# EAGLE board max10adc_v9.0_32chan_frontendtest1 (EAGLE 9.2.0)
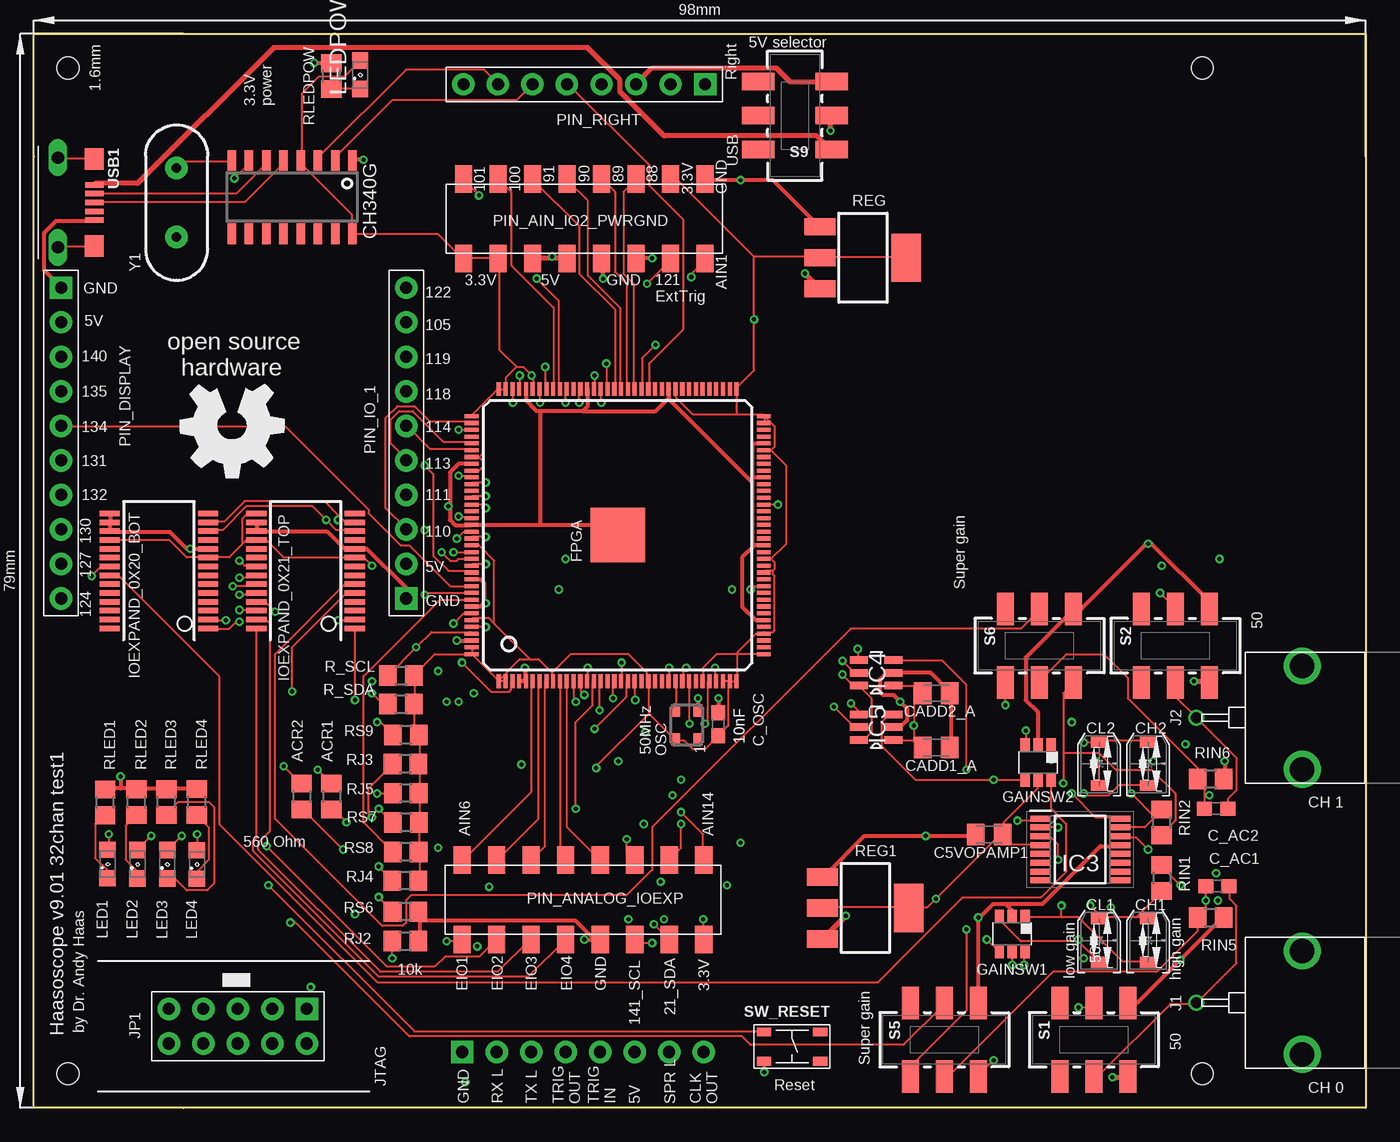
[diagram p3: board, top side]
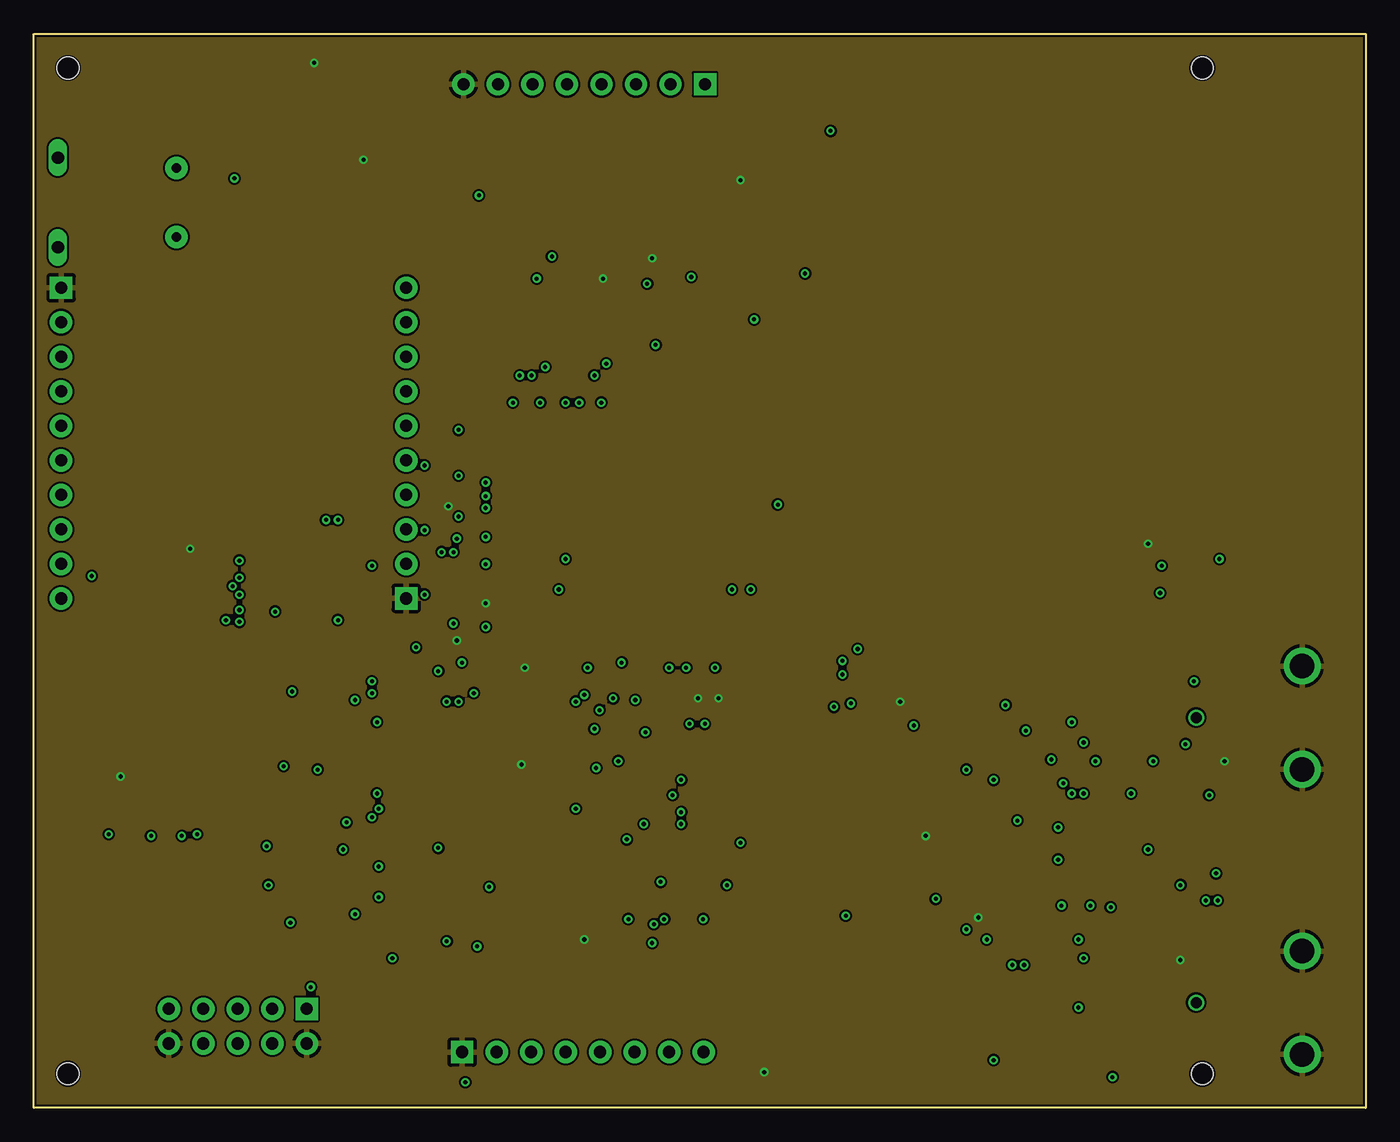
[diagram p4: board, inner layer Route2]
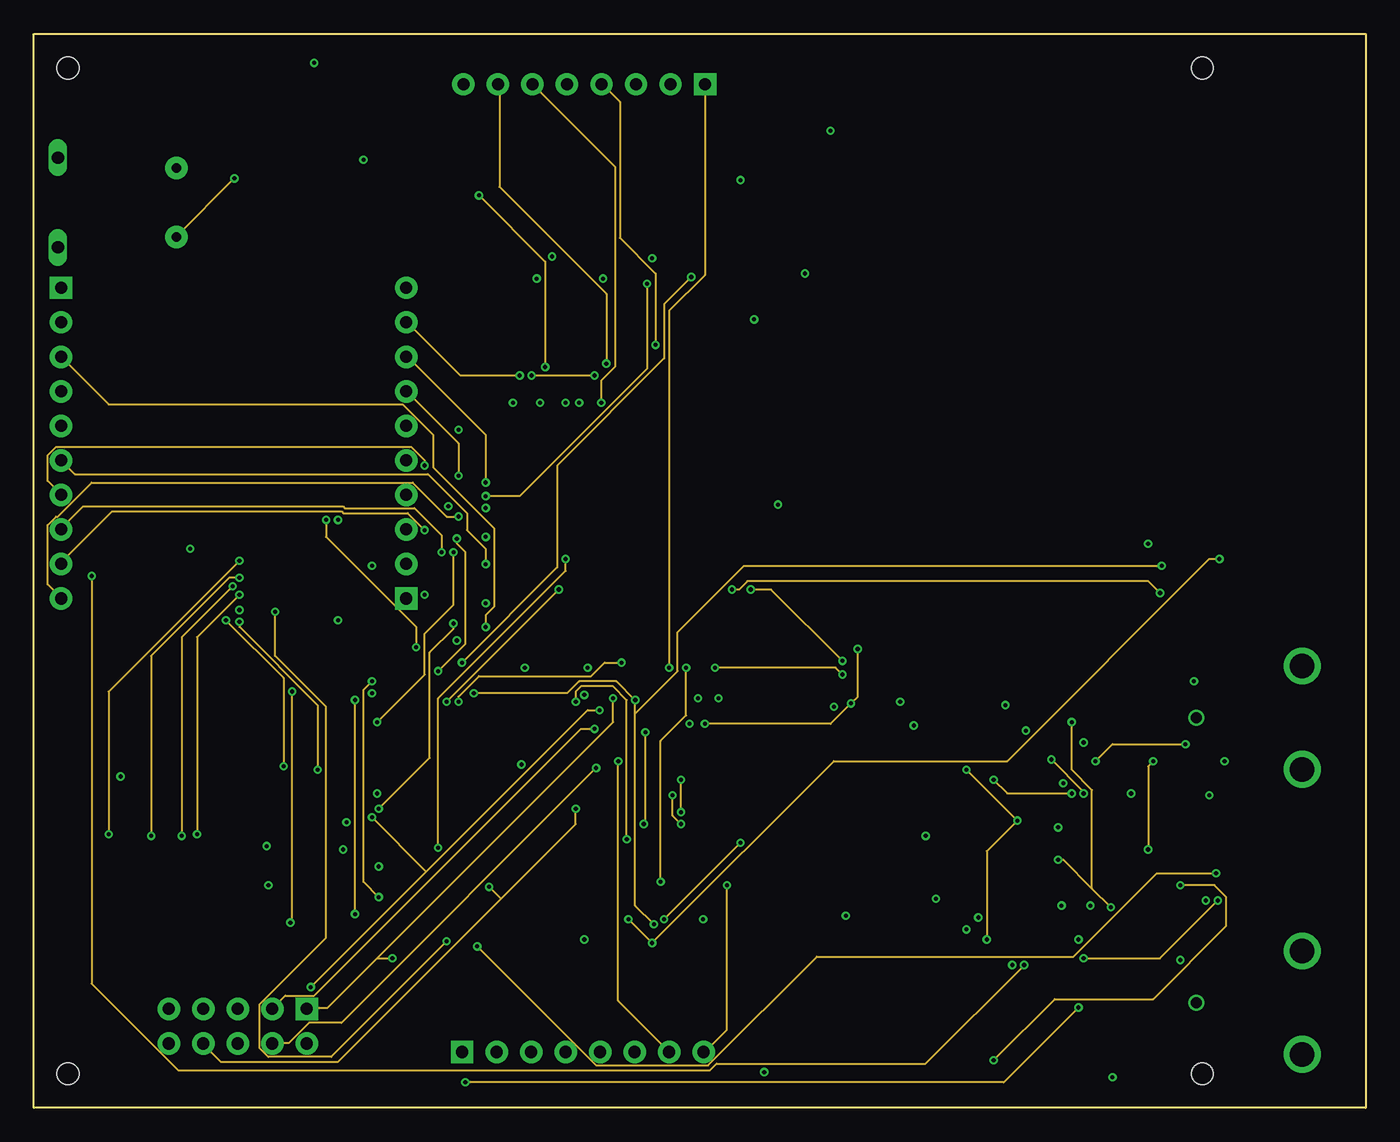
[diagram p5: board, inner layer Route15]
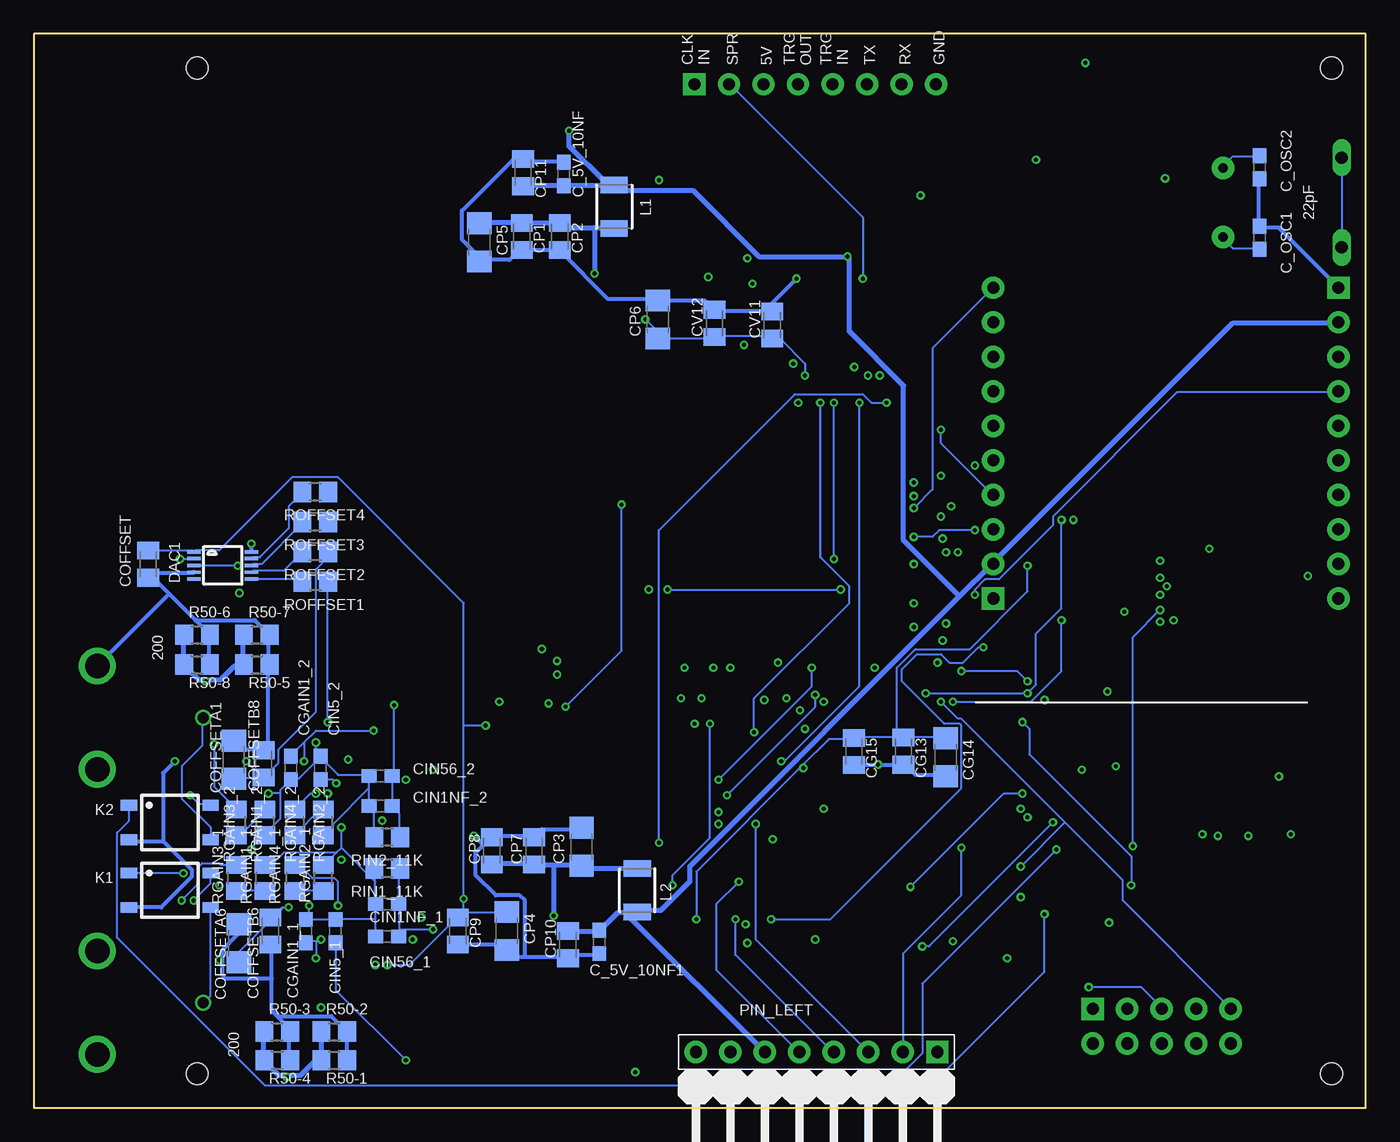
[diagram p6: board, bottom side, seen from below]

Size 98 x 79 mm. Coordinates in mm from the lower left corner, seen from the top.
Outline: 0,0 0,79 98,79 98,0 0,0
Copper layers (1*2*15*16): Top 0.035mm / dielectric 0.2mm / Route2 0.0175mm / dielectric 0.3mm / Route15 0.0175mm / dielectric 0.2mm / Bottom 0.035mm
Design rules "Seeed_AllPCB_MacroFab_haas6mil": minimum track width 6mil, minimum drill 12mil, track to track 6mil, track to pad 6mil, pad to pad 6mil, via to via 6mil, smd to smd 0mil, copper to edge 6mil, drill to drill 6mil, minimum pad ring 6mil, minimum via ring 6mil, stop-mask expansion 6mil, vias tented up to drill 25mil, thermal gap 10mil
Net classes: 0 default: width 0.152 mm; 1 gnd: width 0.305 mm; 2 three: width 0.152 mm; 3 five: width 0.381 mm
Holes 1.6 mm at 86,2.5 86,76.5 2.5,76.5 2.5,2.5

## Footprints (pad centres in the part's own frame; a part is rotated, then mirrored left to right if it is on the bottom)
R0805 = smd 1.3 x 1.5: 1 -0.95,0; 2 0.95,0
C0805K = smd 1.3 x 1.6: 1 -1,0; 2 1,0
C0603 = smd 1.1 x 1: 1 -0.85,0; 2 0.85,0
C1206 = smd 1.6 x 1.8: 1 -1.4,0; 2 1.4,0
CTZ3 = smd 1.2 x 0.8: + 0,1.598; - 0,-1.588
MSOP10 = smd 0.25 x 1: 1 -1,-2.113; 2 -0.5,-2.113; 3 0,-2.113; 4 0.5,-2.113; 5 1,-2.113; 6 1,2.113; 7 0.5,2.113; 8 0,2.113; 9 -0.5,2.113; 10 -1,2.113
EQFP144 = smd 1 x 0.3: 1 -10.75,8.75; 2 -10.75,8.25; 3 -10.75,7.75; 4 -10.75,7.25; 5 -10.75,6.75; 6 -10.75,6.25; 7 -10.75,5.75; 8 -10.75,5.25; 9 -10.75,4.75; 10 -10.75,4.25; 11 -10.75,3.75; 12 -10.75,3.25; 13 -10.75,2.75; 14 -10.75,2.25; 15 -10.75,1.75; 16 -10.75,1.25; 17 -10.75,0.75; 18 -10.75,0.25; 19 -10.75,-0.25; 20 -10.75,-0.75; 21 -10.75,-1.25; 22 -10.75,-1.75; 23 -10.75,-2.25; 24 -10.75,-2.75; 25 -10.75,-3.25; 26 -10.75,-3.75; 27 -10.75,-4.25; 28 -10.75,-4.75; 29 -10.75,-5.25; 30 -10.75,-5.75; 31 -10.75,-6.25; 32 -10.75,-6.75; 33 -10.75,-7.25; 34 -10.75,-7.75; 35 -10.75,-8.25; 36 -10.75,-8.75; 73 10.75,-8.75; 74 10.75,-8.25; 75 10.75,-7.75; 76 10.75,-7.25; 77 10.75,-6.75; 78 10.75,-6.25; 79 10.75,-5.75; 80 10.75,-5.25; 81 10.75,-4.75; 82 10.75,-4.25; 83 10.75,-3.75; 84 10.75,-3.25; 85 10.75,-2.75; 86 10.75,-2.25; 87 10.75,-1.75; 88 10.75,-1.25; 89 10.75,-0.75; 90 10.75,-0.25; 91 10.75,0.25; 92 10.75,0.75; 93 10.75,1.25; 94 10.75,1.75; 95 10.75,2.25; 96 10.75,2.75; 97 10.75,3.25; 98 10.75,3.75; 99 10.75,4.25; 100 10.75,4.75; 101 10.75,5.25; 102 10.75,5.75; 103 10.75,6.25; 104 10.75,6.75; 105 10.75,7.25; 106 10.75,7.75; 107 10.75,8.25; 108 10.75,8.75 | smd 0.3 x 1: 37 -8.75,-10.75; 38 -8.25,-10.75; 39 -7.75,-10.75; 40 -7.25,-10.75; 41 -6.75,-10.75; 42 -6.25,-10.75; 43 -5.75,-10.75; 44 -5.25,-10.75; 45 -4.75,-10.75; 46 -4.25,-10.75; 47 -3.75,-10.75; 48 -3.25,-10.75; 49 -2.75,-10.75; 50 -2.25,-10.75; 51 -1.75,-10.75; 52 -1.25,-10.75; 53 -0.75,-10.75; 54 -0.25,-10.75; 55 0.25,-10.75; 56 0.75,-10.75; 57 1.25,-10.75; 58 1.75,-10.75; 59 2.25,-10.75; 60 2.75,-10.75; 61 3.25,-10.75; 62 3.75,-10.75; 63 4.25,-10.75; 64 4.75,-10.75; 65 5.25,-10.75; 66 5.75,-10.75; 67 6.25,-10.75; 68 6.75,-10.75; 69 7.25,-10.75; 70 7.75,-10.75; 71 8.25,-10.75; 72 8.75,-10.75; 109 8.75,10.75; 110 8.25,10.75; 111 7.75,10.75; 112 7.25,10.75; 113 6.75,10.75; 114 6.25,10.75; 115 5.75,10.75; 116 5.25,10.75; 117 4.75,10.75; 118 4.25,10.75; 119 3.75,10.75; 120 3.25,10.75; 121 2.75,10.75; 122 2.25,10.75; 123 1.75,10.75; 124 1.25,10.75; 125 0.75,10.75; 126 0.25,10.75; 127 -0.25,10.75; 128 -0.75,10.75; 129 -1.25,10.75; 130 -1.75,10.75; 131 -2.25,10.75; 132 -2.75,10.75; 133 -3.25,10.75; 134 -3.75,10.75; 135 -4.25,10.75; 136 -4.75,10.75; 137 -5.25,10.75; 138 -5.75,10.75; 139 -6.25,10.75; 140 -6.75,10.75; 141 -7.25,10.75; 142 -7.75,10.75; 143 -8.25,10.75; 144 -8.75,10.75 | smd 4 x 4: E 0,0
DBV_R-PDSO-G6 = smd 0.69 x 0.99: 1 -0.95,-1.29; 2 0,-1.29; 3 0.95,-1.29; 4 0.95,1.3; 5 0,1.3; 6 -0.95,1.3
SOP65P640X120-16N = smd 1.475 x 0.45: 1 -2.938,2.275; 2 -2.938,1.625; 3 -2.938,0.975; 4 -2.938,0.325; 5 -2.938,-0.325; 6 -2.938,-0.975; 7 -2.938,-1.625; 8 -2.938,-2.275; 9 2.938,-2.275; 10 2.938,-1.625; 11 2.938,-0.975; 12 2.938,-0.325; 13 2.938,0.325; 14 2.938,0.975; 15 2.938,1.625; 16 2.938,2.275
SOT95P280X145-6N = smd 1.321 x 0.559: 1 -1.27,0.94; 2 -1.27,0; 3 -1.27,-0.94; 4 1.27,-0.94; 5 1.27,0; 6 1.27,0.94
SSOP28 = smd 0.4 x 1.5: 1 -4.225,-3.625; 2 -3.575,-3.625; 3 -2.925,-3.625; 4 -2.275,-3.625; 5 -1.625,-3.625; 6 -0.975,-3.625; 7 -0.325,-3.625; 8 0.325,-3.625; 9 0.975,-3.625; 10 1.625,-3.625; 11 2.275,-3.625; 12 2.925,-3.625; 13 3.575,-3.625; 14 4.225,-3.625; 15 4.225,3.625; 16 3.575,3.625; 17 2.925,3.625; 18 2.275,3.625; 19 1.625,3.625; 20 0.975,3.625; 21 0.325,3.625; 22 -0.325,3.625; 23 -0.975,3.625; 24 -1.625,3.625; 25 -2.275,3.625; 26 -2.925,3.625; 27 -3.575,3.625; 28 -4.225,3.625
MOLEX-BNC-73100-0105 = drill 1.8: GND1 -3.8,-3.9; GND2 3.8,-3.9 | drill 0.8: SIGNAL 0,3.9
H2X5-2.54 = drill 0.889 pad 1.651 square: 1 -1.27,5.08 | drill 0.889 pad 1.651: 2 -1.27,2.54; 3 -1.27,0; 4 -1.27,-2.54; 5 -1.27,-5.08; 6 1.27,-5.08; 7 1.27,-2.54; 8 1.27,0; 9 1.27,2.54; 10 1.27,5.08
SOP04 = smd 0.8 x 1.2: 1 -1.27,-3; 2 1.27,-3; 3 1.27,3; 4 -1.27,3
1210 = smd 1.2 x 2: 1 -1.6,0; 2 1.6,0
SML0805 = smd 1.2 x 1.2: A 1.05,0; C -1.05,0
ASE = smd 0.9 x 0.65: 1 -1.05,-0.825; 2 1.05,-0.825; 3 1.05,0.825; 4 -1.05,0.825
2X08_SMT = smd 1.27 x 2.032: 1 -8.89,-2.921; 2 -8.89,2.921; 3 -6.35,-2.921; 4 -6.35,2.921; 5 -3.81,-2.921; 6 -3.81,2.921; 7 -1.27,-2.921; 8 -1.27,2.921; 9 1.27,-2.921; 10 1.27,2.921; 11 3.81,-2.921; 12 3.81,2.921; 13 6.35,-2.921; 14 6.35,2.921; 15 8.89,-2.921; 16 8.89,2.921
H10-2.54 = drill 0.889 pad 1.651 square: 1 0,11.43 | drill 0.889 pad 1.651: 2 0,8.89; 3 0,6.35; 4 0,3.81; 5 0,1.27; 6 0,-1.27; 7 0,-3.81; 8 0,-6.35; 9 0,-8.89; 10 0,-11.43
H8-2.54-90D-MALE = drill 0.889 pad 1.651 square: 1 0,8.89 | drill 0.889 pad 1.651: 2 0,6.35; 3 0,3.81; 4 0,1.27; 5 0,-1.27; 6 0,-3.81; 7 0,-6.35; 8 0,-8.89
H8-2.54-90D-FEMALE = drill 0.889 pad 1.651 square: 1 0,8.89 | drill 0.889 pad 1.651: 2 0,6.35; 3 0,3.81; 4 0,1.27; 5 0,-1.27; 6 0,-3.81; 7 0,-6.35; 8 0,-8.89
SOT-223 = smd 1.27 x 2.286: 1 -2.286,-3.175; 2 0,-3.175; 3 2.286,-3.175 | smd 3.556 x 2.159: TER 0,3.175
JS202011SCQN = smd 1.27 x 2.4: 1 -2.5,-2.7; 2 0,-2.7; 3 2.5,-2.7; 4 -2.5,2.7; 5 0,2.7; 6 2.5,2.7
TACT4.2MM = smd 1.05 x 0.65: P$1 -2.075,1.075; P$2 2.075,1.075; P$3 -2.075,-1.075; P$4 2.075,-1.075
SOIC16 = smd 0.635 x 1.524: 1 -4.445,-2.695; 2 -3.175,-2.695; 3 -1.905,-2.695; 4 -0.635,-2.695; 5 0.635,-2.695; 6 1.905,-2.695; 7 3.175,-2.695; 8 4.445,-2.695; 9 4.445,2.695; 10 3.175,2.695; 11 1.905,2.695; 12 0.635,2.695; 13 -0.635,2.695; 14 -1.905,2.695; 15 -3.175,2.695; 16 -4.445,2.695
10118193-0001LF = smd 0.4 x 1.35: 1 -1.3,2.54; 2 -0.65,2.54; 3 0,2.54; 4 0.65,2.54; 5 1.3,2.54 | drill 0.9 long: S1 -3.3,-0.135; S2 3.3,-0.135 | smd 1.6 x 1.4: S3 -3.2,2.54; S4 3.2,2.54
HC49US = drill 0.7 pad 1.651: 1 -2.54,0; 2 2.54,0

## Placement (x,y rotation side)
ACR1  560  [R0805]  21.9,22.9 270 top
ACR2  560  [R0805]  19.7,22.9 270 top
C5VOPAMP1  0.1uF  [C0805K]  70.3,20.1 180 top
C_5V_10NF  0.01uF  [C0603]  59,68.7 270 bottom
C_5V_10NF1  0.01uF  [C0603]  56.4,12.2 90 bottom
C_AC1  0.01uF  [C0603]  87.1,16.3 0 top
C_AC2  0.01uF  [C0603]  87,22 0 top
C_OSC  0.01uF  [C0603]  50.36,28.22 90 top
C_OSC1  22pF  [C0603]  7.8,64 90 bottom
C_OSC2  22pF  [C0603]  7.8,69.2 270 bottom
CADD1_A  0.1uF  [C0805K]  66.4,26.5 0 top
CADD2_A  0.1uF  [C0805K]  66.4,30.5 0 top
CG13  1uF  [C0805K]  34.01,26.23 270 bottom
CG14  10uF  [C1206]  30.91,25.79 270 bottom
CG15  0.1uF  [C0805K]  37.65,26.21 270 bottom
CGAIN1_1  33pF  [C0603]  78,13 270 bottom
CGAIN1_2  33pF  [C0603]  79.1,25 90 bottom
CH1  3-10pF  [CTZ3]  82,12.3 0 top
CH2  3-10pF  [CTZ3]  82,25.3 0 top
CIN1NF_1  1nF  [C0603]  72,15 180 bottom
CIN1NF_2  1nF  [C0603]  72.5,22.2 180 bottom
CIN5_1  10pF  [C0603]  75.8,13 90 bottom
CIN5_2  10pF  [C0603]  76.9,25 90 bottom
CIN56_1  56pF  [C0603]  72,12.6 180 bottom
CIN56_2  56pF  [C0603]  72.5,24.4 180 bottom
CL1  8-45pF  [CTZ3]  78.4,12.3 0 top
CL2  8-45pF  [CTZ3]  78.4,25.3 0 top
COFFSET  0.1uF  [C0805K]  89.6,40 90 bottom
COFFSETA1  10uF  [C1206]  83.3,25.6 270 bottom
COFFSETA6  10uF  [C1206]  82.9,12.1 270 bottom
COFFSETB6  0.1uF  [C0805K]  80.6,13 90 bottom
COFFSETB8  0.1uF  [C0805K]  81.1,25.3 270 bottom
CP1  1uF  [C0805K]  62.1,64.1 270 bottom
CP2  0.1uF  [C0805K]  59.3,64.1 270 bottom
CP3  10uF  [C1206]  57.7,19.2 90 bottom
CP4  10uF  [C1206]  63.2,13 270 bottom
CP5  10uF  [C1206]  65.22,63.67 270 bottom
CP6  10uF  [C1206]  52.08,58 90 bottom
CP7  1uF  [C0805K]  61.2,18.9 90 bottom
CP8  0.1uF  [C0805K]  64.3,18.9 90 bottom
CP9  1uF  [C0805K]  66.8,13 270 bottom
CP10  1uF  [C0805K]  58.7,12 90 bottom
CP11  1uF  [C0805K]  62,68.8 270 bottom
CV11  0.1uF  [C0805K]  43.67,57.59 90 bottom
CV12  1uF  [C0805K]  47.91,57.71 90 bottom
DAC1  MCP4728  [MSOP10]  84.1,39.9 270 bottom
FPGA  10M08SAE144  [EQFP144]  42.96,42.13 90 top
GAINSW1  741G3157DBVR  [DBV_R-PDSO-G6]  72,12.8 180 top
GAINSW2  741G3157DBVR  [DBV_R-PDSO-G6]  73.9,25.4 180 top
GOLD_ORB_SM1  OSHWLOGOLOGO8MM  [OSHW_8MM]  14.6,50.2 180 top
IC3  OPA4322AIPWR  [SOP65P640X120-16N]  77,19 0 top
IC4  MAX11115AUT+T  [SOT95P280X145-6N]  62,32 180 top
IC5  MAX11115AUT+T  [SOT95P280X145-6N]  62,28 180 top
IOEXPAND_0X20_BOT  MCP23017SS  [SSOP28]  9.2,39.5 90 top
IOEXPAND_0X21_TOP  MCP23017SS  [SSOP28]  20,39.5 90 top
J1  MOLEX_BNC_73100-0105  [MOLEX-BNC-73100-0105]  89.44,7.73 90 top
J2  MOLEX_BNC_73100-0105  [MOLEX-BNC-73100-0105]  89.44,28.7 90 top
JP1  2x5p-2.54  [H2X5-2.54]  15,6 270 top
K1  AQY21SOP  [SOP04]  88,16 270 bottom
K2  AQY21SOP  [SOP04]  88,21 270 bottom
L1  10uH  [1210]  55.3,66.3 270 bottom
L2  10uH  [1210]  53.6,16 90 bottom
LED1  MF-LED-0805-RED  [SML0805]  5.42,17.93 90 top
LED2  MF-LED-0805-RED  [SML0805]  7.62,17.92 90 top
LED3  MF-LED-0805-RED  [SML0805]  9.82,17.91 90 top
LED4  MF-LED-0805-RED  [SML0805]  12,17.9 90 top
LEDPOW  MF-LED-0805-RED  [SML0805]  24,76 90 top
OSC  ASE-50.000MHZ-ET  [ASE]  48.04,28.16 90 top
PIN_AIN_IO2_PWRGND  15-91-2160  [2X08_SMT]  40.5,65.4 180 top
PIN_ANALOG_IOEXP  15-91-2160  [2X08_SMT]  40.4,15.3 0 top
PIN_DISPLAY  YELLOW-10P-2.54  [H10-2.54]  2,48.9 0 top
PIN_IO_1  YELLOW-10P-2.54  [H10-2.54]  27.4,48.9 180 top
PIN_LEFT  8p-2.54-90d  [H8-2.54-90D-MALE]  40.4,4.1 270 bottom
PIN_RIGHT  8p-2.54-90d  [H8-2.54-90D-FEMALE]  40.5,75.3 270 top
R50-1  200R  [R0805]  75.9,3.5 0 bottom
R50-2  200R  [R0805]  75.9,5.6 0 bottom
R50-3  200R  [R0805]  80.1,5.6 0 bottom
R50-4  200R  [R0805]  80.1,3.5 0 bottom
R50-5  200R  [R0805]  81.6,32.6 0 bottom
R50-6  200R  [R0805]  86,34.8 0 bottom
R50-7  200R  [R0805]  81.6,34.8 0 bottom
R50-8  200R  [R0805]  86,32.6 0 bottom
R_SCL  10K  [R0805]  27,31.8 0 top
R_SDA  10K  [R0805]  27,29.7 0 top
REG  LDL1117S33R  [SOT-223]  61.01,62.54 270 top
REG1  LDL1117S33R  [SOT-223]  61.2,14.7 270 top
RGAIN1_1  100k  [R0805]  81,16.9 90 bottom
RGAIN1_2  100k  [R0805]  81,21 270 bottom
RGAIN2_1  1M  [R0805]  76.7,16.9 90 bottom
RGAIN2_2  1M  [R0805]  76.7,21 270 bottom
RGAIN3_1  100k  [R0805]  83.1,16.9 270 bottom
RGAIN3_2  100k  [R0805]  83.1,21 270 bottom
RGAIN4_1  1M  [R0805]  78.8,16.9 270 bottom
RGAIN4_2  1M  [R0805]  78.8,21 270 bottom
RIN1  1.1M  [R0805]  83,16.9 270 top
RIN1_11K  11K  [R0805]  72,17.6 180 bottom
RIN2  1.1M  [R0805]  83,21 90 top
RIN2_11K  11K  [R0805]  72,19.9 180 bottom
RIN5  10M  [R0805]  86.6,14 0 top
RIN6  10M  [R0805]  86.6,24.2 0 top
RJ2  10K  [R0805]  27.33,12.26 0 top
RJ3  10K  [R0805]  27.34,25.3 180 top
RJ4  10K  [R0805]  27.33,16.7 180 top
RJ5  10K  [R0805]  27.36,23.14 180 top
RLED1  560  [R0805]  5.24,22.47 90 top
RLED2  560  [R0805]  7.54,22.48 90 top
RLED3  560  [R0805]  9.74,22.49 90 top
RLED4  560  [R0805]  12,22.5 90 top
RLEDPOW  560  [R0805]  21.9,75.9 90 top
ROFFSET1  200  [R0805]  77.3,38.7 180 bottom
ROFFSET2  200R  [R0805]  77.3,40.9 180 bottom
ROFFSET3  200R  [R0805]  77.3,43.1 180 bottom
ROFFSET4  200R  [R0805]  77.3,45.3 180 bottom
RS6  10K  [R0805]  27.34,14.42 180 top
RS7  10K  [R0805]  27.37,20.98 180 top
RS8  10K  [R0805]  27.36,18.82 180 top
RS9  10K  [R0805]  27.37,27.42 180 top
S1  JS202011SCQN  [JS202011SCQN]  78,5 0 top
S2  JS202011SCQN  [JS202011SCQN]  84,34 0 top
S5  JS202011SCQN  [JS202011SCQN]  67,5 0 top
S6  JS202011SCQN  [JS202011SCQN]  74,34 0 top
S9  JS202011SCQN  [JS202011SCQN]  56,73 90 top
SW_RESET  MF-SW-TACT-4.2MM  [TACT4.2MM]  55.8,4.5 180 top
U340G  CH340G  [SOIC16]  19,67 180 top
USB1  MF-CON-MICROUSB-RIGHT  [10118193-0001LF]  1.9,66.6 270 top
Y1  ABL-12.000MHZ-B2  [HC49US]  10.5,66.6 90 top

## Tracks (layer width: path | path; a pad name or v marks a point on that pad's centre or on a via)
5VINFROMRIGHT
  Top 0.381: S9.3 55.62,75.5 54.62,76.5 45.5,76.5 44.38,75.38 PIN_RIGHT.3
5VINFROMUSB
  Top 0.381: USB1.1 4.5,68 7.62,68 17.62,78 40.75,78 43.12,75.62 43.12,74.75 46.38,71.5 57.62,71.5 58.62,70.5 S9.1
+3V3  (via drill 0.3)
  Top 0.152: LEDPOW.A 24,77 22.88,75.88 21,75.88 19.75,74.62 19.75,69.75 U340G.4 19.75,69.62 19.75,69.38 23.38,65.75 23.38,64.38 U340G.16 23.5,64.25 29.75,64.25 31.5,62.5 PIN_AIN_IO2_PWRGND.16 31.62,62.5 34.12,62.5 PIN_AIN_IO2_PWRGND.14 34.25,62.38 34.25,55.75 35.5,54.5 | v41.25,53.88 41.25,53 FPGA.94 | 32.75,47.88 33,47.62 33,47.12 32.75,46.88 32.25,46.88 FPGA.117 | 32.75,47.88 32.25,47.88 FPGA.115 | 33,51.75 34.12,52.88 FPGA.108 34.25,52.88 34.62,52.88 FPGA.107 34.75,53 34.75,53.75 35.5,54.5 | 33,51.75 32.25,51 FPGA.109 | 35.5,54.5 36,54.5 v36.62,53.88 36.75,53.75 36.75,53 FPGA.103 | 32.75,47.88 33,48.12 33,51.75 | 53,62.62 47.38,68.25 46.88,68.25 PIN_AIN_IO2_PWRGND.3 | 53,62.62 57.75,62.62 REG.2 57.88,62.62 64.12,62.62 REG.TER | 51.75,51 53.62,51 FPGA.72 53.75,50.88 | 51.75,51 48.5,51 47.25,52.25 47.25,52.88 FPGA.82 | 51.75,51 51.75,52.88 FPGA.73 51.75,53 53,54.25 v53,58 53,62.62 | 54.25,48.38 53.75,48.38 FPGA.67 | 54.25,48.38 54.5,48.62 54.5,50.12 53.75,50.88 | 53.75,50.88 53.75,50.5 FPGA.71 | 54.38,39.5 53.75,39.5 FPGA.49 | 54.38,39.5 54.5,39.62 54.5,40.12 54.25,40.38 | 54.25,40.38 53.75,40.38 FPGA.51 | 51.12,31.38 50.75,31.38 FPGA.34 | 51.75,33.38 53.62,33.38 FPGA.37 | 51.75,33.38 51.62,33.38 | 51.62,33.38 50.25,33.38 49.25,32.38 49.25,31.5 FPGA.31 | 51.62,33.38 53.12,34.88 53.62,34.88 FPGA.40 53.75,35 54.38,35 54.5,35.12 54.5,39.12 54.38,39.25 54.38,39.5 | 51.75,33.38 51.75,31.5 FPGA.36 51.62,31.38 51.25,31.38 FPGA.35 51.12,31.38 | 54.25,48.38 55.38,47.25 55.38,41.5 54.25,40.38 | FPGA.144 32.25,33.5 32.25,33.88 FPGA.143 | FPGA.1 34.25,31.38 34.62,31.38 FPGA.2 | 38.12,32 38.12,31.5 FPGA.9
  Top 0.152: 38.12,32 37.12,33 36.5,33 | 36.5,33 35.75,33 34.25,31.5 FPGA.1 | 36.5,33 33.88,35.62 | 33.88,35.62 33.5,36 32.25,36 FPGA.139 | 33.88,35.62 33.88,40.25 32.75,41.38 32.25,41.38 FPGA.128 | FPGA.144 32.25,33.38 34.12,31.5 FPGA.1 | RJ4.1 28.38,16.75 28.38,18.75 RS8.1 28.38,18.88 28.38,20.88 RS7.1 28.38,21 28.38,23.12 RJ5.1 28.38,23.25 28.38,25.25 RJ3.1 28.38,25.38 28.38,27.38 RS9.1 28.25,27.5 28,27.75 28,29.62 R_SDA.2 28,29.75 28,31.75 R_SCL.2 28,31.88 29.5,33.38 32.12,33.38 FPGA.144 | 15.38,41.5 15.62,41.75 16.38,41.75 | 15.38,41.5 14.38,40.5 12.88,40.5 IOEXPAND_0X20_BOT.9 12.75,40.5 11.25,40.5 10,41.75 5.62,41.75 IOEXPAND_0X20_BOT.18 | 15.38,41.5 15.38,43.38 15.62,43.62 16.38,43.62 IOEXPAND_0X21_TOP.15 | 16.38,41.75 17.12,41.75 18.38,40.5 23.62,40.5 IOEXPAND_0X21_TOP.9 23.62,40.38 24.38,40.38 v24.88,39.88 | 16.38,41.75 IOEXPAND_0X21_TOP.18 | 45.25,29 45.25,31.38 FPGA.23 45.12,31.5 45.12,32 43.75,33.38 39.5,33.38 38.12,32 | 45.25,29 47.12,27.12 OSC.4 47.25,27 47.88,27 48.5,26.38 49.38,26.38 50.25,27.25 C_OSC.1 50.38,27.38 51.12,28.12 51.12,31.38 | v49.25,13.88 49.25,12.5 PIN_ANALOG_IOEXP.15 | 45.25,29 41.38,25.12 v41.38,25
  Route15 0.152: v36.62,53.88 v41.25,53.88 | v41.38,25 22.62,6.25 20.25,6.25 18.75,4.75 17.62,4.75 JP1.9
  Bottom 0.152: v41.25,53.88 41.25,54.75 43,56.5 43.62,56.5 CV11.1 43.75,56.62 43.88,56.75 47.88,56.75 CV12.1 48,56.62 52,56.62 CP6.1 52.12,56.62 52.12,57.12 v53,58 | CG13.1 34,27.25 31,27.25 CG14.1 | 34.5,27.25 34.12,27.25 CG13.1 | 34.5,27.25 37.62,27.25 CG15.1 37.75,27.12 39.5,27.12 41.5,25.12 | v49.25,13.88 49.25,17.38 41.5,25.12 | 41.5,25.12 v41.38,25 | v24.88,39.88 24.88,38 29.12,33.75 33.12,33.75 34.5,32.38 34.5,27.25 | 34.5,27.25 CG13.1
+5V  (via drill 0.3)
  Top 0.381: 38.12,62.5 39.12,62.5 PIN_AIN_IO2_PWRGND.10 | 38.12,62.5 36.75,62.5 PIN_AIN_IO2_PWRGND.12 | v58.62,71.88 58.62,73 S9.2 | v38.12,62.62 38.12,62.5
  Bottom 0.381: CP11.2 62,67.88 59,67.88 C_5V_10NF.2 58.88,67.88 55.38,67.88 L1.1 | v58.62,71.88 58.62,70.75 55.88,68 L1.1 | L1.1 55.12,67.88 54.75,67.5 49.5,67.5 44.62,62.62 v38.12,62.62 38,62.5 38,57.12 34,53.12 34,41.75 29.88,37.62 | CP10.2 56.5,13 C_5V_10NF1.2 56.25,13.12 55,14.38 53.62,14.38 L2.1 | PIN_LEFT.6 44.25,4.12 54.38,14.25 L2.1 | PIN_DISPLAY.2 2,57.75 9.75,57.75 27.38,40.12 PIN_IO_1.2 27.5,40 29.88,37.62 | 29.88,37.62 49.75,17.75 49.75,16.62 51.88,14.5 53.5,14.5 L2.1
A6
  Top 0.152: FPGA.6 36.62,31.38 36.62,23.25 31.62,18.25 PIN_ANALOG_IOEXP.2
A7
  Top 0.152: FPGA.7 37.12,31.38 37.12,21.25 34.12,18.25 PIN_ANALOG_IOEXP.4
A8
  Top 0.152: FPGA.8 37.62,31.38 37.62,19.25 36.62,18.25 PIN_ANALOG_IOEXP.6
A10
  Top 0.152: FPGA.10 38.75,31.38 38.75,18.62 39.12,18.25 PIN_ANALOG_IOEXP.8
A11
  Top 0.152: FPGA.11 39.25,31.38 39.25,20.62 41.62,18.25 PIN_ANALOG_IOEXP.10
A12  (via drill 0.3)
  Top 0.152: v39.88,29.88 39.75,30 39.75,31.38 FPGA.12 | v43.62,19.75 43.62,18.75 44.12,18.25 PIN_ANALOG_IOEXP.12
  Route15 0.152: v39.88,29.88 39.88,30.62 40.25,31 42.62,31 43.62,30 v43.62,19.75
A13  (via drill 0.3)
  Top 0.152: v40.5,30.38 40.25,30.62 40.25,31.38 FPGA.13 | v47.62,20.88 47.62,19.12 46.75,18.25 PIN_ANALOG_IOEXP.14
  Route15 0.152: v47,23 47,21.5 v47.62,20.88
  Bottom 0.152: v40.5,30.38 40.5,29.5 v47,23
A14  (via drill 0.3)
  Top 0.152: v40.75,32.38 40.75,31.5 FPGA.14 | v47.62,21.75 49.25,20.12 49.25,18.25 PIN_ANALOG_IOEXP.16
  Route15 0.152: v47.62,21.75 v47.62,24.12
  Bottom 0.152: v40.75,32.38 40.75,31 v47.62,24.12
AIN1  (via drill 0.3)
  Top 0.152: v31.5,32.75 33.62,30.62 35,30.62 35.12,30.75 35.12,31.38 FPGA.3 | v48.38,61.12 48.38,61.38 49.38,62.38 PIN_AIN_IO2_PWRGND.2
  Route15 0.152: v31.5,32.75 38.5,39.75 38.5,47.25 46.38,55.12 46.38,59.12 v48.38,61.12
CGAIN1  (via drill 0.3)
  Top 0.152: 76.88,12.25 72.62,12.25 71.12,13.75 71.12,14 GAINSW1.3 | 76.88,12.25 78.38,10.75 CL1.- | 76.88,12.25 v76.88,12.38
  Route15 0.152: v87.12,15.25 82.88,11 v77.25,11
  Bottom 0.152: 77.25,12.25 77,12.25 v76.88,12.38 | 77.25,12.25 78,12.25 CGAIN1_1.2 | v87.12,15.25 85.88,16.5 85.88,17.75 85.62,18 84.38,18 84.25,17.88 83.12,17.88 RGAIN3_1.1 | 77.25,12.25 v77.25,11
CGAIN2  (via drill 0.3)
  Top 0.152: 75.62,14 76.88,14 80.12,10.75 82,10.75 CH1.- | 75.62,14 73,14 GAINSW1.1 | 75.62,14 v75.62,14.88
  Bottom 0.152: v75.62,14.88 75.62,16.62 75.88,16.88 77.5,16.88 78.38,17.75 78.75,17.75 RGAIN4_1.1
CGAIN3  (via drill 0.3)
  Top 0.152: v73,27.75 73,26.75 GAINSW2.3 | v78.12,25.5 78.38,25.25 78.38,23.75 CL2.-
  Route15 0.152: v84.75,26.75 79.38,26.75 v78.12,25.5
  Bottom 0.152: v73,27.75 77.25,27.75 78.12,26.88 | 78.12,26.88 79.12,25.88 CGAIN1_2.2 | 78.12,26.88 v78.12,25.5 | v84.75,26.75 84.75,23.62 83.12,22 RGAIN3_2.1
CGAIN4  (via drill 0.3)
  Top 0.152: v74.88,25.62 74.88,26.62 GAINSW2.1 | v77.25,23.12 77.38,23 79.12,23 79.88,23.75 82,23.75 CH2.-
  Route15 0.152: v74.88,25.62 77.25,23.25 v77.25,23.12
  Bottom 0.152: v77.25,23.12 77.62,23.12 RGAIN4_2.1
CLKINFROMRIGHT_26  (via drill 0.3)
  Top 0.152: v46.75,32.38 46.75,31.5 FPGA.26
  Route15 0.152: v46.75,32.38 46.75,58.62 49.38,61.25 49.38,75.25 PIN_RIGHT.1
CLKOUT_32  (via drill 0.3)
  Top 0.152: v49.38,28.25 49.62,28.5 49.62,31.38 FPGA.32 | v60.12,29.75 60.62,29.25 60.62,29 IC5.4 | v60.62,33.75 60.62,33 IC4.4
  Route15 0.152: v49.38,28.25 58.62,28.25 v60.12,29.75 60.62,30.25 v60.62,33.75
CLKOUT_33  (via drill 0.3)
  Top 0.152: v50.12,32.38 50.12,31.5 FPGA.33 | v59.5,31.88 60.25,31.12 60.62,31.12 IC4.6 60.75,31 61.62,30.12 61.62,27.62 61.12,27.12 60.75,27.12 IC5.6
  Route15 0.152: v50.12,32.38 59,32.38 v59.5,31.88
CLKOUTTOLEFT_29  (via drill 0.3)
  Top 0.152: v48.25,28.25 48.25,31.38 FPGA.29
  Route15 0.152: v51,16.38 51,5.75 49.38,4.12 PIN_LEFT.8
  Bottom 0.152: v48.25,28.25 48.25,19.88 51,17.12 v51,16.38
CONF  (via drill 0.3)
  Top 0.152: v30.88,35.62 31.62,36.38 32.12,36.38 FPGA.138 | v25.38,22 26.38,21 RS7.2
  Route15 0.152: v30.88,35.62 30.88,35.25 29.12,33.5 29.12,25.75 v25.38,22
CONFIG_SEL  (via drill 0.3)
  Top 0.152: v31.12,41.88 31.62,42.38 32.12,42.38 FPGA.126 | v25.38,15.5 26.38,14.5 RS6.2
  Route15 0.152: v31.12,41.88 31.12,41.5 31.75,40.88 31.75,34.12 v29.75,32.12 | v24.88,31.38 24.25,30.75 24.25,16.62 v25.38,15.5
  Bottom 0.152: v29.75,32.12 25.62,32.12 v24.88,31.38
D0A  (via drill 0.3)
  Top 0.152: v52.75,38.12 53,38.38 53.62,38.38 FPGA.47 | v59.5,32.88 60.38,32 IC4.5
  Route15 0.152: v52.75,38.12 54.25,38.12 v59.5,32.88
D0B  (via drill 0.3)
  Top 0.152: v54.75,44.38 53.75,44.38 FPGA.59 | v58.88,29.5 60.38,28 IC5.5
  Bottom 0.152: v54.75,44.38 54.75,33.62 v58.88,29.5
DMINUS
  Top 0.152: USB1.2 14.88,67.25 17,69.38 17,69.62 U340G.6
DPLUS
  Top 0.152: USB1.3 4.5,66.62 15.5,66.62 18.25,69.38 18.25,69.62 U340G.5
E_21_B0  (via drill 0.3)
  Top 0.152: v23.62,30 IOEXPAND_0X21_TOP.1 | v76.88,7.38 77.75,7.38 78,7.62 S1.5
  Route15 0.152: v23.62,14.25 v23.62,30 | v31.75,1.88 71.38,1.88 v76.88,7.38
  Bottom 0.152: v23.62,14.25 23.62,10 v31.75,1.88
E_21_B1  (via drill 0.3)
  Top 0.152: v22.38,35.88 23.62,35.88 IOEXPAND_0X21_TOP.2 | v82.88,37.88 84,36.75 S2.5
  Route15 0.152: v38.62,38.12 v30.38,29.88 | v51.38,38.12 51.88,38.12 52.5,38.75 82,38.75 v82.88,37.88
  Bottom 0.152: v22.38,35.88 22.38,32.12 24.62,29.88 v30.38,29.88 | v51.38,38.12 v38.62,38.12
E_21_B4  (via drill 0.3)
  Top 0.152: IOEXPAND_0X21_TOP.5 23,37.88 19,33.88 v19,30.62 | v18.88,13.62 19.25,13.62 27.62,5.25 52.12,5.25 52.75,4.62 64,4.62 67,7.62 S5.5
  Route15 0.152: v19,30.62 19,13.75 v18.88,13.62
E_21_B5
  Top 0.152: IOEXPAND_0X21_TOP.6 23.62,38.5 22.88,38.5 17.75,33.38 17.75,21.25 25.62,13.38 27.12,13.38 27.38,13.62 27.38,15.25 27.75,15.62 43.62,15.62 45.5,17.5 45.5,20.62 60.12,35.25 72.62,35.25 74,36.62 S6.5
E_ACSW1  (via drill 0.3)
  Top 0.152: v20.88,24.88 ACR1.1 | v15.12,35.75 14.88,35.75 14.38,35.25 12.88,35.25 IOEXPAND_0X20_BOT.1
  Route15 0.152: v20.88,24.88 20.88,29.62 15.12,35.38 v15.12,35.75
E_ACSW2  (via drill 0.3)
  Top 0.152: v18.38,25.12 19.62,23.88 ACR2.1 | v14.12,35.88 12.88,35.88 IOEXPAND_0X20_BOT.2
  Route15 0.152: v18.38,25.12 18.38,31.62 v14.12,35.88
E_GSW1  (via drill 0.3)
  Top 0.152: v72.88,10.5 72.88,11.5 GAINSW1.6 | v4.25,39.12 4.88,39.75 5.5,39.75 IOEXPAND_0X20_BOT.21
  Route15 0.152: v72.88,10.5 65.62,3.25 50.25,3.25 49.75,2.75 10.62,2.75 4.25,9.12 v4.25,39.12
E_GSW2
  Top 0.152: GAINSW2.6 74.88,24 74.88,22 76,20.88 76,17.38 74.12,15.5 68.38,15.5 62.12,9.25 25.25,9.25 13.62,20.88 13.62,31.75 6.25,39.12 5.62,39.12 IOEXPAND_0X20_BOT.22
E_IO_1  (via drill 0.3)
  Top 0.152: v17.75,36.5 17.12,37.12 16.38,37.12 IOEXPAND_0X21_TOP.25 | v30.38,12.25 31.38,12.25 PIN_ANALOG_IOEXP.1
  Route15 0.152: v17.75,36.5 17.75,33.25 21.5,29.5 21.5,12.5 16.62,7.62 16.62,4.38 17.25,3.75 21.88,3.75 v30.38,12.25
E_IO_2  (via drill 0.3)
  Top 0.152: v15.12,36.62 16.38,36.62 IOEXPAND_0X21_TOP.26 | v17.12,19.25 26,10.38 29.5,10.38 30.25,11.12 32.75,11.12 34,12.38 PIN_ANALOG_IOEXP.3
  Bottom 0.152: v15.12,36.62 17.12,34.62 v17.12,19.25
E_IO_3
  Top 0.152: IOEXPAND_0X21_TOP.27 16.38,35.88 17.12,35.88 17.38,35.62 17.38,20.38 16.5,19.5 16.5,19 25.5,10 34.12,10 36.5,12.38 PIN_ANALOG_IOEXP.5
E_IO_4
  Top 0.152: IOEXPAND_0X21_TOP.28 16.38,19.88 16.12,19.62 16.12,18.88 25.38,9.62 36.38,9.62 PIN_ANALOG_IOEXP.7
GND  (via drill 0.3)
  Top 0.305: 30.62,44.25 30.62,46.75 31.25,47.38 32.12,47.38 FPGA.116 | 30.62,44.25 30.62,43.25 31,42.88 32.12,42.88 FPGA.125 32.25,42.88 37.25,42.88 | 37.25,42.88 42.25,42.88 42.88,42.25 FPGA.E | 40.38,51.25 37.25,51.25 | 37.25,51.25 37,51.25 36.25,52 36.25,52.88 FPGA.104 | 40.38,51.25 40.75,51.62 40.75,52.88 FPGA.95 | 46.75,52.25 46.75,52.88 FPGA.83 | 46.75,52.25 45.75,51.25 40.38,51.25 | 52.94,41.31 53,41.38 53.62,41.38 FPGA.53 | 52.94,41.31 52.12,40.5 52.12,36.88 53.12,35.88 53.62,35.88 FPGA.42 | 53,46.38 53.62,46.38 FPGA.63 | 53,46.38 52.88,46.25 52.88,46.12 | 52.88,46.12 52.88,41.38 52.94,41.31 | FPGA.68 53.62,48.88 53,48.88 52.88,48.75 52.88,46.38 53,46.38 | 46.75,52.25 46.75,52.12 52.75,46.12 52.88,46.12 | 37.25,51.25 37.25,42.88 | GAINSW1.2 72,14.5 71.56,14.94 | 71.56,14.94 71.5,15 70.62,15 69.56,13.94 | 69.56,13.94 69.5,13.88 S5.6 | IC3.13 79.88,19.25 78.5,19.25 74.25,15 71.62,15 71.56,14.94 | C5VOPAMP1.2 69.25,20 v65.62,20 61.12,20 58.12,17 REG1.1 | RIN5.2 87.5,14 v84.38,10.88 81.25,7.75 80.5,7.75 S1.6 | PIN_AIN_IO2_PWRGND.1 49.5,68.25 v52,68.25 54.38,68.25 57.75,64.88 REG.1 | GAINSW2.2 73.88,26.75 73.88,29.12 73,30 73,33.12 76.5,36.62 S6.6 76.62,36.75 77.12,36.75 81.88,41.5 v82,41.5 82.25,41.5 86.5,37.25 S2.6 | IOEXPAND_0X20_BOT.15 5.62,43.62 5.62,43.12 IOEXPAND_0X20_BOT.16 5.62,43 5.62,42.5 IOEXPAND_0X20_BOT.17 5.62,42.38 10,42.38 11.25,41.12 v11.5,41.12 IOEXPAND_0X20_BOT.10 | IC5.2 63.75,28 64.25,28.5 64.25,29.38 v63.75,29.88 63.25,30.38 62.5,30.38 62.25,30.62 62.25,31.5 62.75,32 IC4.2 66,32 67.38,30.62 CADD2_A.2 67.5,30.5 67.5,26.5 CADD1_A.2 | 6.38,23.5 7.5,23.5 RLED2.2 7.62,23.5 9.62,23.5 RLED3.2 9.88,23.5 12,23.5 RLED4.2
  Top 0.305: 6.38,23.5 5.25,23.5 RLED1.2 | RJ2.2 28.38,12.38 28.38,14.38 RS6.1 28.5,13.75 39.88,13.75 41.12,12.5 PIN_ANALOG_IOEXP.9 41.62,12.38 v40.5,12.38 | 33.12,37.12 32.88,36.88 32.25,36.88 FPGA.137 | 33.12,37.12 33.12,38.62 32.88,38.88 32.25,38.88 FPGA.133 | IOEXPAND_0X21_TOP.16 IOEXPAND_0X21_TOP.17 16.5,42.38 21.62,42.38 22.88,41.12 IOEXPAND_0X21_TOP.10 24.5,41.12 27.38,38.25 27.38,37.5 PIN_IO_1.1 | FPGA.4 35.75,31.38 36.12,31.38 FPGA.5 36.12,31.5 v36.12,32.38 | v48.88,30.12 48.88,29.25 OSC.2 | v31.12,34.38 32.12,34.38 FPGA.142 | v53.75,2.62 53.75,3.38 SW_RESET.P$2 | v50.38,30.12 50.38,29.12 C_OSC.2 | USB1.5 4.38,65.25 1.62,65.25 0.75,64.38 0.75,61.62 2,60.38 PIN_DISPLAY.1 | v20.62,76.88 21.88,76.88 RLEDPOW.2 | v87.62,25.5 87.62,24.25 RIN6.2 | v24.25,69.75 23.5,69.75 U340G.1 | v33.25,37.12 33.12,37.12 | v41.88,61 41.88,62.38 PIN_AIN_IO2_PWRGND.8 | v45.5,62.5 44.38,62.5 PIN_AIN_IO2_PWRGND.6 | v6.38,24.38 6.38,23.5 | v69.5,14 69.56,13.94 | v30.5,44.25 30.62,44.25
  Bottom 0.305: CP8.2 64.25,20 61.25,20 CP7.2 61.12,20 60.62,20.5 57.75,20.5 CP3.2 | C_5V_10NF1.1 56.5,11.25 58.38,11.25 58.62,11 CP10.1 58.75,11.12 61.88,11.12 | CP9.2 63.62,12 63.25,11.62 CP4.2 63.12,11.5 62.75,11.12 61.88,11.12 | 61.88,11.12 61.88,15.25 62.25,15.62 64,15.62 65.5,17.12 65.5,18.75 64.38,19.88 CP8.2 | R50-1.2 75,3.5 75,5.5 R50-2.2 75,5.62 76.12,6.75 80,6.75 80.06,6.69 | R50-4.2 79.25,3.5 79.25,5.5 R50-3.2 79.12,5.75 80.06,6.69 | 80.5,9.5 80.5,7.12 80.06,6.69 | 80.5,9.5 80.5,12 COFFSETB6.1 | 84.12,10.88 84.12,9.75 83.88,9.5 80.5,9.5 | 84.12,10.88 84.12,11.62 83,12.75 83,13.5 COFFSETA6.1 | C_5V_10NF.1 59,69.62 61.88,69.62 62,69.75 CP11.1 62.12,69.75 62.75,69.75 66.5,66 66.5,63.88 65.12,62.5 CP5.2 65.12,62.38 63,62.38 62.25,63.12 CP1.2 62,63.12 59.38,63.12 CP2.2 59.25,63 55.75,59.5 52.12,59.5 CP6.2 52,59.38 48.62,59.38 48,58.75 CV12.2 47.88,58.62 43.75,58.62 CV11.2 43.75,58.75 43.75,59.12 v41.88,61 | COFFSETA1.1 83.25,27 82.62,26.38 81.12,26.38 COFFSETB8.1 81.12,26.5 80.75,26.88 80.75,32.5 R50-5.2 80.75,32.62 80.75,34.75 R50-7.2 80.75,34.88 81.75,35.88 86,35.88 86.06,35.81 | R50-8.2 85.12,32.62 85.12,34.75 R50-6.2 86.06,35.81 | 89.38,39.12 89.5,39 COFFSET.1 89.38,39.12 | 89.38,39.12 89.12,39.38 86.25,39.38 DAC1.4 | 89.38,39.12 88.06,37.81 | 88.06,37.81 86.06,35.81 | CG15.2 37.62,25.25 v35.88,25.25 34.12,25.25 CG13.2 33.88,25.25 33.12,24.5 31,24.5 CG14.2 | 88.5,19.62 86.38,17.5 86.38,17 88.62,14.75 91,14.75 K1.2 | 88.5,19.62 91,19.62 K2.2 | C_OSC2.2 7.88,68.25 7.88,64.88 C_OSC1.2 7.75,64.75 6.38,64.75 2,60.38 PIN_DISPLAY.1 | v82,41.5 82,41 DAC1.10
  Bottom 0.305: 88.5,19.62 88.5,24.62 v87.62,25.5 | 88.06,37.81 93.38,32.5 J2.GND2 | v84.38,10.88 84.12,10.88 | v65.62,20 65,19.38 CP8.2
  pour Route2: -4,0 -3,79 99,79 98,0
INA1  (via drill 0.3)
  Top 0.152: v70.12,12.38 71,11.5 GAINSW1.4 | v72.38,21.12 73.88,21.12 74,21.25 IC3.1 | v68.62,24.88 68.62,31.12 66.88,32.88 63.38,32.88 IC4.3
  Route15 0.152: v70.12,12.38 70.12,18.88 v72.38,21.12 v68.62,24.88
INAMINUS1  (via drill 0.3)
  Top 0.152: v75.38,20.62 IC3.2 | 81.12,14 82,14 CH1.+ | 81.12,14 78.5,14 CL1.+ 78.38,14 78.38,14.25 v77.75,14.88 | 81.12,14 83,15.88 RIN1.2
  Bottom 0.152: 75.38,19.12 v75.38,20.62 | 75.75,18.75 76.62,17.88 RGAIN2_1.2 | 75.75,18.75 75.38,19.12 | 75.75,18.75 79.62,18.75 80.5,17.88 81,17.88 RGAIN1_1.2 | 77.75,13.88 78,13.88 CGAIN1_1.1 77.75,13.88 | 77.75,13.88 75.88,13.88 CIN5_1.2 75.75,13.88 72.88,13.88 | 72.88,15 72.88,13.88 | 72.88,13.88 72.88,12.62 CIN56_1.2 | 72.88,15 72.88,16.62 | 72.88,16.62 72.88,17.5 RIN1_11K.2 | 72.88,15 CIN1NF_1.2 | 77.75,13.88 v77.75,14.88 | 72.88,16.62 75.38,19.12
INB1  (via drill 0.3)
  Top 0.152: GAINSW2.4 72.88,24.12 v70.62,24.12 64.88,24.12 62.38,26.62 62.38,28.38 62.88,28.88 63.25,28.88 IC5.3 | v76.38,23.12 78.12,21.38 79.88,21.38 IC3.16
  Route15 0.152: v76.38,23.12 71.62,23.12 v70.62,24.12
INBMINUS1  (via drill 0.3)
  Top 0.152: IC3.15 81.75,20.62 82.5,21.38 | 82.5,21.38 83,21.88 RIN2.2 82.5,21.38 | CH2.+ 82,27 78.5,27 CL2.+ 78.38,26.88 v77.25,26.88 | v80.75,23.12 82.5,21.38
  Bottom 0.152: 73.38,23.5 73.38,24.38 CIN56_2.2 73.38,24.5 75.62,24.5 76.88,25.75 CIN5_2.2 77.25,25.5 | 73.38,23.5 73.38,22.25 CIN1NF_2.2 73.25,22.12 73,21.88 73,20 RIN2_11K.2 | RGAIN2_2.2 76,20.75 76,20.88 73.38,23.5 | 77.25,25.5 78.5,24.25 79,24.25 CGAIN1_2.1 79.88,23.38 79.88,23.12 | 79.88,23.12 79.88,21.25 81,20.12 RGAIN1_2.2 | 77.25,25.5 v77.25,26.88 | 79.88,23.12 v80.75,23.12
INJ1
  Top 0.152: C_AC1.2 88,16.25 88,15.38 88.5,14.88 88.5,10.62 85.62,7.75 J1.SIGNAL 85.5,7.62 83.62,7.62 78.38,2.38 78,2.38 S1.2
  Bottom 0.152: K1.3 85,8.25 85.5,7.75 J1.SIGNAL
INJ2
  Top 0.152: C_AC2.2 87.88,22 87.88,22.75 88.5,23.38 88.5,25.75 85.62,28.62 J2.SIGNAL 85.5,28.75 84,30.25 S2.2
  Bottom 0.152: K2.3 85,20.62 87.12,22.75 87.12,25.12 85.62,26.62 85.62,28.62 J2.SIGNAL
IO_100
  Top 0.152: FPGA.100 38.25,53 38.25,58.88 35.12,62 35.12,67.38 34.25,68.25 PIN_AIN_IO2_PWRGND.13
IO_101  (via drill 0.3)
  Top 0.152: v37.62,54.5 37.62,53 FPGA.101 | v32.75,67.12 31.62,68.25 PIN_AIN_IO2_PWRGND.15
  Route15 0.152: v37.62,54.5 37.62,62.25 v32.75,67.12
IO_105  (via drill 0.3)
  Top 0.152: v35.75,53.88 35.75,53 FPGA.105
  Route15 0.152: v35.75,53.88 31.38,53.88 27.5,57.75 PIN_IO_1.9
IO_110
  Top 0.152: FPGA.110 32.12,50.5 29.12,50.5 28,51.62 26.75,51.62 25.88,50.75 25.88,44.12 27.38,42.62 PIN_IO_1.3
IO_111  (via drill 0.3)
  Top 0.152: v31.25,49.88 32.12,49.88 FPGA.111
  Bottom 0.152: v31.25,49.88 31.25,48.88 27.5,45.12 PIN_IO_1.4
IO_113
  Top 0.152: FPGA.113 32.12,49 30.12,49 27.88,51.25 26.88,51.25 26.25,50.62 26.25,48.88 27.38,47.75 PIN_IO_1.5
IO_114
  Top 0.152: FPGA.114 32.12,48.5 29.12,48.5 27.5,50.12 PIN_IO_1.6
IO_118  (via drill 0.3)
  Top 0.152: v31.25,46.5 32.12,46.5 FPGA.118
  Route15 0.152: v31.25,46.5 31.25,48.88 27.5,52.62 PIN_IO_1.7
IO_119  (via drill 0.3)
  Top 0.152: v33.25,46 32.25,46 FPGA.119
  Route15 0.152: v33.25,46 33.25,49.5 27.5,55.25 PIN_IO_1.8
IO_122  (via drill 0.3)
  Top 0.152: v33.25,44.12 33,44.38 32.25,44.38 FPGA.122
  Bottom 0.152: v33.25,44.12 31.88,45.5 31.88,55.88 27.5,60.25 PIN_IO_1.10
IO_CLK_88
  Top 0.152: FPGA.88 44.12,53 44.12,60.62 43.38,61.38 43.38,67.38 44.25,68.25 PIN_AIN_IO2_PWRGND.5
IO_CLK_89
  Top 0.152: FPGA.89 43.62,53 43.62,60.62 42.75,61.5 42.75,67.38 41.88,68.25 PIN_AIN_IO2_PWRGND.7
IO_CLK_90
  Top 0.152: FPGA.90 43.12,53 43.12,58.88 40.75,61.25 40.75,66.75 39.25,68.25 PIN_AIN_IO2_PWRGND.9
IO_CLK_91
  Top 0.152: FPGA.91 42.75,53 42.75,58.75 40.12,61.38 40.12,64.88 36.75,68.25 PIN_AIN_IO2_PWRGND.11
JTAGEN  (via drill 0.3)
  Top 0.152: v39.88,22 39.88,28.38 41.12,29.62 41.12,31.38 FPGA.15 | v25.25,23.12 26.38,23.12 RJ5.2
  Route15 0.152: v39.88,22 39.88,20.88 34.38,15.38 | 34.38,15.38 22.38,3.38 13.75,3.38 12.5,4.62 JP1.7 | 34.38,15.38 v33.5,16.25
  Bottom 0.152: v25.25,23.12 26.62,23.12 v33.5,16.25
L21_SDA  (via drill 0.3)
  Top 0.152: 22.5,43.5 22.88,43.12 23.62,43.12 IOEXPAND_0X21_TOP.13 | 22.5,43.5 21.38,44.62 15.5,44.62 14,43.12 12.88,43.12 IOEXPAND_0X20_BOT.13 | v44.25,30 44.25,31.38 FPGA.21 | v45.62,13.5 PIN_ANALOG_IOEXP.13 | v24.88,30.5 25.62,29.75 26,29.75 R_SDA.1 | 22.5,43.5 22.5,43.38 v22.38,43.25
  Route15 0.152: 44.25,29 44.25,14.88 v45.62,13.5 | 44.25,29 v44.25,30 42.88,31.38 40.12,31.38 39.25,30.5 v32.38,30.5 | v83,39.88 52.25,39.88 47.38,35 47.38,32.12 44.25,29
  Bottom 0.152: v83,39.88 86.12,39.88 DAC1.3 | v32.38,30.5 v24.88,30.5 24.25,31.12 24.25,34.88 22.38,36.75 v22.38,43.25
L121  (via drill 0.3)
  Top 0.152: v33.25,45 32.25,45 FPGA.121 | v45.12,60.62 46.88,62.38 PIN_AIN_IO2_PWRGND.4
  Route15 0.152: v33.25,45 35.75,45 45.12,54.38 v45.12,60.62
L124  (via drill 0.3)
  Top 0.152: v31.25,43.5 32.12,43.5 FPGA.124
  Route15 0.152: v31.25,43.5 30.38,43.5 27.88,46 4.25,46 1.75,43.5 1.62,43.5 1,42.88 1,38.5 2,37.5 PIN_DISPLAY.10
L127  (via drill 0.3)
  Top 0.152: v33.25,42 32.25,42 FPGA.127
  Route15 0.152: v28.75,42.5 27.5,43.75 22.75,43.75 22.62,43.88 5.75,43.88 2,40.12 PIN_DISPLAY.9
  Bottom 0.152: v33.25,42 31.88,42 31.38,42.5 v28.75,42.5
L130  (via drill 0.3)
  Top 0.152: v30,40.88 30.62,40.25 31.12,40.25 31.25,40.38 32.12,40.38 FPGA.130
  Route15 0.152: v30,40.88 30,42.12 28,44.12 22.88,44.12 22.75,44.25 3.62,44.25 2,42.62 PIN_DISPLAY.8
L131  (via drill 0.3)
  Top 0.152: v33.25,40 32.25,40 FPGA.131
  Route15 0.152: v33.25,40 33.25,41.12 31.88,42.5 31.88,43.75 29,46.62 3,46.62 PIN_DISPLAY.6
L132  (via drill 0.3)
  Top 0.152: v28.75,47.25 29.38,46.62 29.38,40.62 30.5,39.5 32.12,39.5 FPGA.132
  Route15 0.152: v28.75,47.25 28.75,47.62 27.75,48.62 1.62,48.62 1,48 1,46.12 2,45.12 PIN_DISPLAY.7
L134
  Top 0.152: FPGA.134 32.12,38.38 30.62,38.38 27.62,41.38 27,41.38 24.62,43.75 24.62,44 18.5,50.12 2,50.12 PIN_DISPLAY.5
L135  (via drill 0.3)
  Top 0.152: v28.75,37.75 28.88,37.88 32.12,37.88 FPGA.135
  Bottom 0.152: v28.75,37.75 28.75,38.12 28,38.88 27,38.88 23,42.88 23,43.5 13.88,52.62 2,52.62 PIN_DISPLAY.4
L140  (via drill 0.3)
  Top 0.152: v33.25,35.38 32.25,35.38 FPGA.140
  Route15 0.152: v33.25,35.38 33.25,36.25 33.88,36.88 33.88,42.62 29.38,47.12 29.38,49.5 27.12,51.75 5.5,51.75 PIN_DISPLAY.3
L141_SCL  (via drill 0.3)
  Top 0.152: R_SCL.1 v28.12,33.88 29.25,35 32.12,35 FPGA.141 | IOEXPAND_0X20_BOT.12 12.88,42.5 13.88,42.5 15.62,44.25 20.5,44.25 v21.5,43.25 22.25,42.5 23.62,42.5 IOEXPAND_0X21_TOP.12 | v45.5,12.12 44.5,12.12 44.25,12.38 PIN_ANALOG_IOEXP.11
  Route15 0.152: v28.12,33.88 28.12,35.38 21.5,42 v21.5,43.25 | v87.25,40.38 86.5,40.38 71.62,25.5 58.88,25.5 v45.5,12.12 v43.75,13.88
  Bottom 0.152: v87.25,40.38 86.25,40.38 DAC1.2 | v28.12,33.88 28.5,33.88 29.62,32.75 30.62,32.75 31.25,33.38 33,33.38 34.12,32.25 34.12,31.38 31,28.25 29.88,28.25 29.75,28.12 29.75,23.5 39.38,13.88 v43.75,13.88
LED1  (via drill 0.3)
  Top 0.152: v5.5,20.12 5.5,19 LED1.A | v15.12,40.25 15.5,39.88 16.38,39.88 IOEXPAND_0X21_TOP.21
  Route15 0.152: v5.5,20.12 5.5,30.62 v15.12,40.25
LED2  (via drill 0.3)
  Top 0.152: v8.62,20 7.62,19 LED2.A | v15.12,39 16.25,39 16.38,39.12 IOEXPAND_0X21_TOP.22
  Route15 0.152: v8.62,20 8.62,33.25 14.38,39 v15.12,39
LED3  (via drill 0.3)
  Top 0.152: v10.88,20 9.88,19 LED3.A | v14.62,38.38 16.25,38.38 16.38,38.5 IOEXPAND_0X21_TOP.23
  Route15 0.152: v10.88,20 10.88,34.62 v14.62,38.38
LED4  (via drill 0.3)
  Top 0.152: v12,20.12 LED4.A | v15.12,37.75 16.25,37.75 IOEXPAND_0X21_TOP.24
  Route15 0.152: v12,20.12 12,34.62 v15.12,37.75
N50_1  (via drill 0.3)
  Top 0.381: v79.38,2.25 80.5,2.25 S1.3
  Bottom 0.381: R50-2.1 76.88,5.5 76.88,3.5 R50-1.1 77,3.38 77.38,3.38 78.38,2.38 79.38,2.38 | R50-3.1 81.12,5.5 81.12,3.5 R50-4.1 81,3.38 80,2.38 79.38,2.38 | v79.38,2.25 79.38,2.38
N$1
  Top 0.152: LED4.C 12,17.38 12.88,18.25 12.88,20.62 12,21.5 RLED4.1
N$2
  Bottom 0.152: RGAIN1_1.1 81,16 83,16 RGAIN3_1.2
N$3
  Bottom 0.152: RGAIN2_1.1 76.75,16 78.75,16 RGAIN4_1.2
N$4
  Bottom 0.152: RGAIN3_2.2 83,20.12 82.75,20.12 81,21.88 RGAIN1_2.1
N$5
  Bottom 0.152: RGAIN2_2.1 76.75,21.88 77,21.88 78.75,20.12 RGAIN4_2.2
N$10  (via drill 0.3)
  Top 0.152: C_AC1.1 v86.25,15.25 86.25,14.5 85.75,14 RIN5.1 85.62,14 85.62,13 82.62,10 75,10 67.38,2.38 67,2.38 S5.2
  Bottom 0.152: K1.4 85,16.5 v86.25,15.25
N$11  (via drill 0.3)
  Top 0.152: v23,21 22,22 ACR1.2
  Route15 0.152: v87,17.25 82.62,17.25 76.5,11.12 57.62,11.12 49.62,3.12 41.38,3.12 v32.62,11.88
  Bottom 0.152: v87,17.25 91,17.25 K1.1 | v32.62,11.88 32.12,11.88 v23,21
N$12
  Top 0.152: LED3.C 9.88,16.75 10.5,16.75 11.25,16 12.75,16 13.25,16.5 13.25,22.12 12.88,22.5 10.62,22.5 9.75,21.62 RLED3.1
N$13
  Top 0.152: LED2.C 7.5,16.88 7.5,17.5 6.75,18.25 6.75,20.75 7.5,21.5 RLED2.1
N$14
  Top 0.152: LED1.C 5.38,17 5.38,17.5 4.5,18.38 4.5,20.88 5.12,21.5 RLED1.1
N$15  (via drill 0.3)
  Top 0.152: 86.12,23 86.12,23.75 85.75,24.12 RIN6.1 85.62,24.25 85.62,25 80.5,30.12 80.5,31.62 78.75,33.38 76,33.38 74,31.38 S6.2 | 86.12,23 86.12,22 C_AC2.1 | 86.12,23 v86.5,23
  Bottom 0.152: v86.5,23 85.88,22.38 85,22.38 K2.4
N$19  (via drill 0.3)
  Top 0.152: v71.5,29.62 S6.1
  Bottom 0.152: RIN2_11K.1 71.12,20 71.12,21.62 71.62,22.12 CIN1NF_2.1 71.62,22.25 71.62,24.38 CIN56_2.1 71.62,24.5 71.5,24.62 v71.5,29.62
N$21  (via drill 0.3)
  Top 0.152: v22.75,19 19.75,22 ACR2.2
  Bottom 0.152: K2.1 91,21.12 91.88,20.25 91.88,12.5 81,1.62 35,1.62 32.62,4 32.62,9.12 v22.75,19
N$22  (via drill 0.3)
  Top 0.152: 75.75,26.12 75.75,30.5 76.5,31.25 S6.3 | 75.75,26.12 v75.75,23.88 | 75.75,26.12 78.38,26.12 79.62,24.88 82.25,24.88 84,23.12 84,21.12 83,20.12 RIN2.1
  Bottom 0.152: v75.75,23.88 76,24.12 76.88,24.12 CIN5_2.1
N$23  (via drill 0.3)
  Top 0.152: v14.75,68.38 15.75,69.38 15.75,69.62 U340G.7
  Route15 0.152: v14.75,68.38 10.5,64.12 Y1.1
  Bottom 0.152: C_OSC1.1 7.88,63.25 9.75,63.25 10.5,64 Y1.1
N$25  (via drill 0.3)
  Top 0.381: v85.38,31.38 86.5,31.38 S2.3
  Bottom 0.381: R50-7.1 82.62,34.75 82.62,32.62 R50-5.1 82.75,32.5 83.25,32.5 84.25,31.5 85.38,31.5 | R50-6.1 87,34.75 87,32.62 R50-8.1 86.88,32.5 85.88,31.5 85.38,31.5 | v85.38,31.38 85.38,31.5
N$31
  Top 0.152: U340G.8 14.5,69.62 10.88,69.62 10.5,69.25 Y1.2
  Bottom 0.152: C_OSC2.1 7.88,70 9.75,70 10.5,69.25 Y1.2
N$34
  Top 0.152: LEDPOW.C 24,75 22,75 RLEDPOW.1
N$44
  Bottom 0.152: DAC1.6 81.88,38.88 78.38,38.88 78.25,38.75 ROFFSET1.2
N$45
  Bottom 0.152: DAC1.7 81.88,39.5 79.62,39.5 78.25,40.88 ROFFSET2.2
N$46
  Bottom 0.152: DAC1.8 81.88,40 81.25,40 78.25,43 ROFFSET3.2
N$47
  Bottom 0.152: DAC1.9 81.88,40.5 81.38,40.5 79.25,42.62 79.25,44.25 78.25,45.25 ROFFSET4.2
N$48  (via drill 0.3)
  Top 0.381: v59.75,14.12 58.12,12.5 REG1.3
  Bottom 0.381: CP8.1 64.25,18 61.25,18 CP7.1 61.12,17.88 59.75,17.88 | 59.75,17.88 57.75,17.88 CP3.1 57.62,17.62 53.62,17.62 L2.2 | 59.75,17.88 v59.75,14.12
N$49  (via drill 0.3)
  Top 0.381: v56.75,61.38 57.75,60.38 REG.3
  Bottom 0.381: CP5.1 65.12,65.12 62.25,65.12 CP1.1 62,65.12 59.38,65.12 CP2.1 59.12,65.12 58.75,64.75 56.75,64.75 | 56.75,64.75 55.38,64.75 L1.2 | 56.75,64.75 v56.75,61.38
NCONF  (via drill 0.3)
  Top 0.152: v30.88,40.88 32.12,40.88 FPGA.129 | v25.25,28.38 25.5,28.38 26.38,27.5 RS9.2 | v17.25,16.38 28,5.62 53.62,5.62 SW_RESET.P$4
  Route15 0.152: v30.88,40.88 30.88,37 28.75,34.88 28.75,31.88 v25.25,28.38
  Bottom 0.152: v17.25,16.38 17.25,18.5 24.75,26 24.75,27.88 v25.25,28.38
NNG_1  (via drill 0.3)
  Top 0.152: v70.62,3.5 69.5,2.38 S5.3 | v84.38,16.38 83,17.75 RIN1.1
  Route15 0.152: v84.38,16.38 86.88,16.38 87.75,15.5 87.75,13.38 82.38,8 75.12,8 v70.62,3.5
  Bottom 0.152: v70.62,3.5 75.75,8.62 75.75,12.12 CIN5_1.1
NSG_1  (via drill 0.3)
  Top 0.152: S5.1 64.5,3 68.62,7.12 v68.62,13.12
  Bottom 0.152: 71.12,15 71.12,13.12 | 71.12,13.12 71.12,12.62 CIN56_1.1 | 71.12,15 71.12,17.5 RIN1_11K.1 | 71.12,15 CIN1NF_1.1 | 71.12,13.12 v68.62,13.12
OFFSET1  (via drill 0.3)
  Top 0.152: v75.38,18.25 75.38,19.38 74.88,19.88 74.12,19.88 IC3.3
  Route15 0.152: v75.38,18.25 75.75,18.25 77.88,16.12 | v79.25,14.75 77.88,16.12 | v76.38,28.38 76.38,24.88 77.88,23.38 77.88,16.12
  Bottom 0.152: 79.62,14.75 79.75,14.75 80.5,14 COFFSETB6.2 | 79.62,14.75 v79.25,14.75 | v76.38,28.38 76.38,38.62 ROFFSET1.1 | 79.62,14.75 82.88,11.5 82.88,10.75 COFFSETA6.2
OFFSET2  (via drill 0.3)
  Top 0.152: v82,19 81.12,19.88 80,19.88 IC3.14
  Route15 0.152: v82,19 82,25.12 v82.38,25.5
  Bottom 0.152: 81.12,24.25 v82.38,25.5 | ROFFSET2.1 76.38,40.88 76.38,40.5 77.25,39.62 77.25,29.12 80,26.38 80,25.38 81,24.38 COFFSETB8.2 81.12,24.25 | 81.12,24.25 83.25,24.25 COFFSETA1.2
OSC1
  Top 0.152: OSC.3 47.25,29.25 47.25,31.38 FPGA.27
SERIALFROMLEFT_98  (via drill 0.3)
  Top 0.152: v39.12,51.88 39.12,52.88 FPGA.98
  Route15 0.152: v39.12,40.38 39.12,39.5 29.75,30.12 v29.75,19.12
  Bottom 0.152: v39.12,40.38 v39.12,51.88 | v29.75,19.12 29.75,15.62 34,11.38 34,4.12 PIN_LEFT.2
SERIALFROMRIGHT_TX_93  (via drill 0.3)
  Top 0.152: v41.75,51.88 41.75,52.88 FPGA.93 | U340G.2 22.25,69.75 22.25,70 26.38,74.12 35.5,74.12 36.62,75.25 PIN_RIGHT.6
  Route15 0.152: v41.75,51.88 41.75,53.5 42.75,54.5 42.75,69.25 36.75,75.25 PIN_RIGHT.6
SERIALTOLEFT_96  (via drill 0.3)
  Top 0.152: v40.12,51.88 40.12,52.88 FPGA.96
  Route15 0.152: v45,27.62 45,21 v44.88,20.88
  Bottom 0.152: v40.12,51.88 40.12,40.5 38,38.38 38,37.12 45,30.12 v45,27.62 | v44.88,20.88 44.88,12.38 36.62,4.12 PIN_LEFT.3
SERIALTORIGHT_RX_92  (via drill 0.3)
  Top 0.152: v42.12,54.75 42.12,53 FPGA.92 | U340G.3 21,69.75 21,70 27.38,76.38 33.12,76.38 34.12,75.38 PIN_RIGHT.7
  Route15 0.152: v42.12,54.75 42.12,59.88 34.25,67.75 34.25,75.25 PIN_RIGHT.7
SLD
  Top 0.152: USB1.S4 4.38,63.38 1.88,63.38 USB1.S2 | USB1.S3 4.38,69.88 1.88,69.88 USB1.S1
  Bottom 0.152: USB1.S2 1.75,63.38 1.75,69.88 USB1.S1
SPARELEFT_102  (via drill 0.3)
  Top 0.152: v37.25,51.88 37.25,52.88 FPGA.102
  Route15 0.152: v43,25.5 43,7.88 46.75,4.12 PIN_LEFT.7
  Bottom 0.152: v37.25,51.88 37.25,31 42.75,25.5 v43,25.5
SPARERIGHT_99  (via drill 0.3)
  Top 0.152: v37,61 38.62,59.38 38.62,53 FPGA.99
  Bottom 0.152: v37,61 37,65.5 46.75,75.25 PIN_RIGHT.2
STATUS
  Top 0.152: FPGA.136 32.12,37.38 29.88,37.38 24.25,31.75 24.25,21 26.38,18.88 RS8.2
TCK  (via drill 0.3)
  Top 0.152: v42.62,30.12 42.62,31.38 FPGA.18 | v26.38,11 RJ2.1
  Route15 0.152: v42.62,30.12 42.62,28.38 25.25,11 | 25.25,11 21.62,7.38 20.12,7.38 JP1.1 | 25.25,11 v26.38,11
TDI  (via drill 0.3)
  Top 0.152: v43.25,32.75 43.25,31.5 FPGA.19 | v25.38,17.75 26.38,16.75 RJ4.2
  Route15 0.152: v43.25,32.75 42,32.75 41,31.75 32.75,31.75 31.25,30.25 v31.25,29.88
  Bottom 0.152: v31.25,29.88 30,28.62 29.75,28.62 22.12,21 | 22.12,21 17.88,16.75 17.88,15.25 10,7.38 JP1.5 | 22.12,21 v25.38,17.75
TDO  (via drill 0.3)
  Top 0.152: v41.25,27.88 43.62,30.25 43.62,31.38 FPGA.20
  Route15 0.152: v41.25,27.88 40.25,27.88 20.62,8.25 18.5,8.25 17.62,7.38 JP1.2
TMS  (via drill 0.3)
  Top 0.152: v41.62,29.25 41.62,31.38 FPGA.16 | v24.88,21.38 24.62,21.62 24.62,23.5 26.38,25.25 RJ3.2
  Route15 0.152: v41.62,29.25 40.75,29.25 28.88,17.38 | v20.38,8.88 28.88,17.38 | 28.88,17.38 v24.88,21.38
  Bottom 0.152: v20.38,8.88 16.5,8.88 15,7.38 JP1.3
TRIGINFROMLEFT_28  (via drill 0.3)
  Top 0.152: v48,32.38 47.75,32.12 47.75,31.5 FPGA.28
  Route15 0.152: v48,32.38 48,28.88 46.12,27 v46.12,16.62
  Bottom 0.152: v46.12,16.62 47.75,15 47.75,10.12 41.75,4.12 PIN_LEFT.5
TRIGINFROMRIGHT_86
  Top 0.152: FPGA.86 45.25,53 45.25,54.75 47.75,57.25 47.75,65.38 45.25,67.88 45.25,69.38 39.25,75.38 PIN_RIGHT.5
TRIGOUTORIGHT_87  (via drill 0.3)
  Top 0.152: v45.75,56.12 44.75,55.12 44.75,53 FPGA.87
  Route15 0.152: v45.75,56.12 45.75,61.38 43.12,64 43.12,74 41.88,75.25 PIN_RIGHT.4
TRIGOUTTOLEFT_106  (via drill 0.3)
  Top 0.152: v35.25,51.88 35.25,52.88 FPGA.106
  Route15 0.152: v46.38,13.88 v52,19.5
  Bottom 0.152: v35.25,51.88 36.38,51.88 37,52.5 42,52.5 52,42.5 v52,19.5 | v46.38,13.88 46.38,11.25 39.25,4.12 PIN_LEFT.4
VCCA  (via drill 0.3)
  Top 0.152: GAINSW2.5 73.88,24 73.88,23.5 71.38,21 71.38,20.12 C5VOPAMP1.1 | IC3.4 74,19.38 72,19.38 71.38,20 C5VOPAMP1.1 | 64.38,14.75 58.12,14.75 REG1.2 | 64.38,14.75 65.75,14.75 v66.38,15.38 71,20 71.25,20 C5VOPAMP1.1 | 64.38,14.75 REG1.TER | 64.75,27 64.88,27 65.38,26.5 CADD1_A.1 | 64.75,27 63.38,27 IC5.1 | 64.75,31 64.88,31 65.38,30.5 CADD2_A.1 | 64.75,31 63.38,31 IC4.1 | 64.75,31 v64.75,28.12 64.75,27 | v72,10.5 GAINSW1.5
  Bottom 0.152: COFFSET.2 86.25,41 DAC1.1 86.12,41 84.38,41 79,46.38 75.62,46.38 66.38,37.12 66.38,28.12 | v72,10.5 70.38,10.5 66.88,14 CP9.1 | 66.38,14.38 63.25,14.38 CP4.1 | 66.38,14.38 66.75,14 CP9.1 | 66.38,14.38 v66.38,15.38 66.38,28.12 | 66.38,14.38 CP9.1 | 66.38,28.12 v64.75,28.12

## Text on the board
tPlace: 5V selector | Right | 1.6mm | 3.3V / power | USB | 91 | 90 | 89 | 88 | 101 | 100 | 3.3V | GND | 3.3V | 5V | GND | GND | 122 | AIN1 | 121 / ExtTrig | 5V | 105 | 140 | 119 | 135 | 118 | 134 | 114 | 131 | 113 | 132 | 111 | Super gain | 130 | 110 | 127 | 5V | GND | 124 | 50 | 10nF | 10nF | 50MHz | 1 | CH 1 | 560 Ohm | AIN6 | AIN14 | 50 | 10k | low gain | EIO1 | EIO2 | EIO3 | EIO4 | GND | 3.3V | Super gain | high gain | 21_SDA | by Dr. Andy Haas | 141_SCL | 50 | Haasoscope v9.01 32chan test1 | JTAG | Reset | CH 0 | GND | RX L | TX L | TRIG / OUT | TRIG / IN | 5V | SPR L | CLK / OUT
bPlace: GND | RX | TX | TRG / IN | TRG / OUT | 5V | SPR | CLK / IN | 22pF | 200 | 200